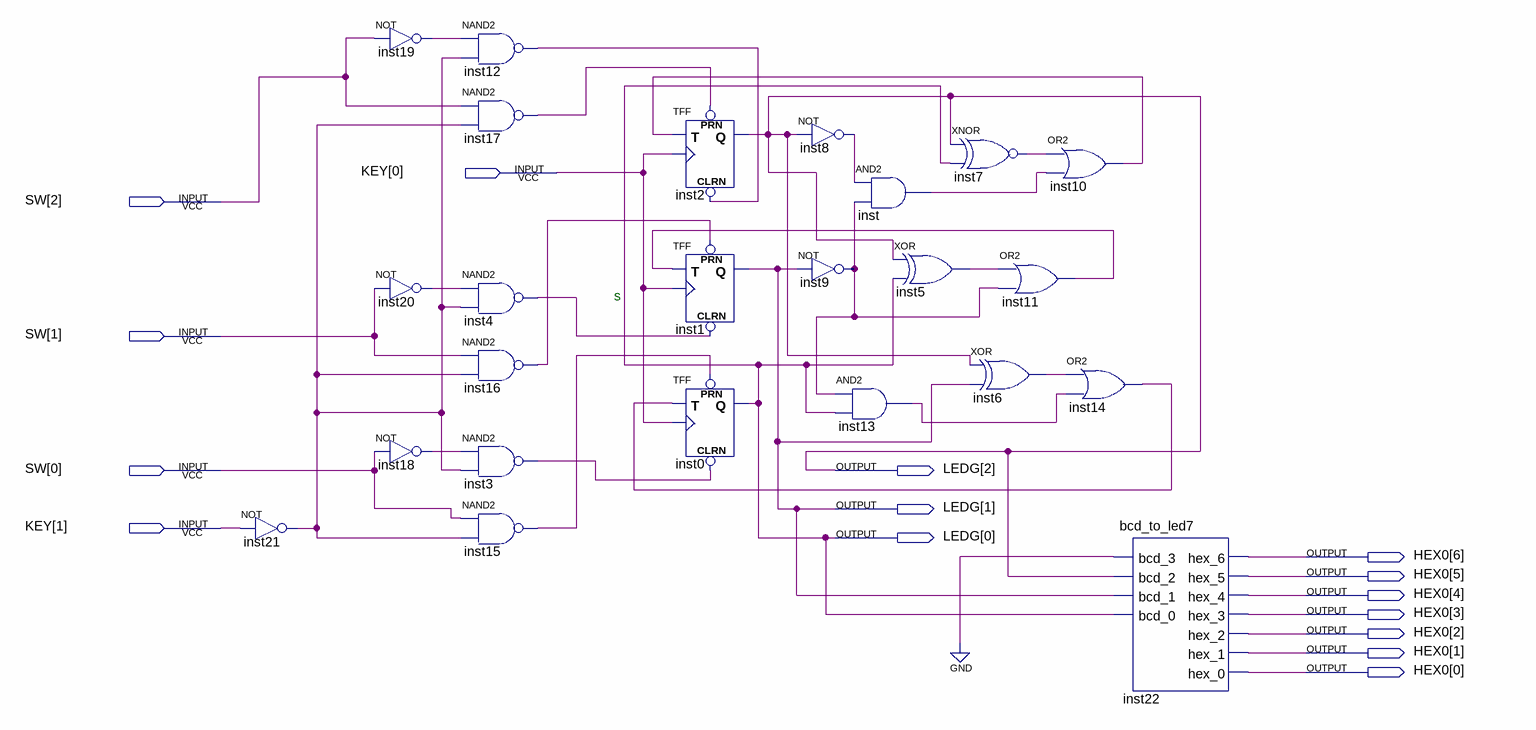
[diagram p0: schematic sheet]
// Quartus schematic Lab01.bdf as structural Verilog: 24 symbols, 15 pins
module Lab01 (
  input  [1:0] KEY,
  input  [2:0] SW,
  output [2:0] LEDG,
  output [6:0] HEX0
);

  wire inst3_out, inst4_out, inst5_out, inst6_out, inst7_out, inst8_out, inst9_out, inst10_out, inst11_out,
       inst12_out, inst13_out, inst14_out, inst15_out, inst16_out, inst17_out, inst18_out, inst19_out,
       inst20_out, inst21_out, inst_out;

  not inst21 (inst21_out, KEY[1]);
  not inst19 (inst19_out, SW[2]);
  not inst20 (inst20_out, SW[1]);
  not inst18 (inst18_out, SW[0]);
  nand inst12 (inst12_out, inst19_out, inst21_out);
  nand inst17 (inst17_out, SW[2], inst21_out);
  nand inst4 (inst4_out, inst20_out, inst21_out);
  nand inst16 (inst16_out, SW[1], inst21_out);
  nand inst3 (inst3_out, inst18_out, inst21_out);
  nand inst15 (inst15_out, SW[0], inst21_out);
  TFF inst2 (.PRN(inst17_out), .CLRN(inst12_out), .T(inst10_out), .CLK(KEY[0]), .Q(LEDG[2]));
  TFF inst1 (.PRN(inst16_out), .CLRN(inst4_out), .T(inst11_out), .CLK(KEY[0]), .Q(LEDG[1]));
  TFF inst0 (.PRN(inst15_out), .CLRN(inst3_out), .T(inst14_out), .CLK(KEY[0]), .Q(LEDG[0]));
  not inst8 (inst8_out, LEDG[2]);
  not inst9 (inst9_out, LEDG[1]);
  and inst (inst_out, inst8_out, inst9_out);
  xor inst5 (inst5_out, LEDG[2], LEDG[0]);
  and inst13 (inst13_out, inst9_out, LEDG[0]);
  xnor inst7 (inst7_out, LEDG[2], LEDG[0]);
  xor inst6 (inst6_out, LEDG[2], LEDG[1]);
  or inst10 (inst10_out, inst7_out, inst_out);
  or inst11 (inst11_out, inst5_out, inst9_out);
  or inst14 (inst14_out, inst6_out, inst13_out);
  bcd_to_led7 inst22 (
    .bcd_3(1'b0), .bcd_2(LEDG[2]), .bcd_1(LEDG[1]), .bcd_0(LEDG[0]), .hex_6(HEX0[6]), .hex_5(HEX0[5]),
    .hex_4(HEX0[4]), .hex_3(HEX0[3]), .hex_2(HEX0[2]), .hex_1(HEX0[1]), .hex_0(HEX0[0]));

  // Notes on the sheet:
  //   s
endmodule
